# Altium schematic sheet WEATHER_PCB.SchDoc
size A3; SheetNumber: 1; SheetTotal: 1
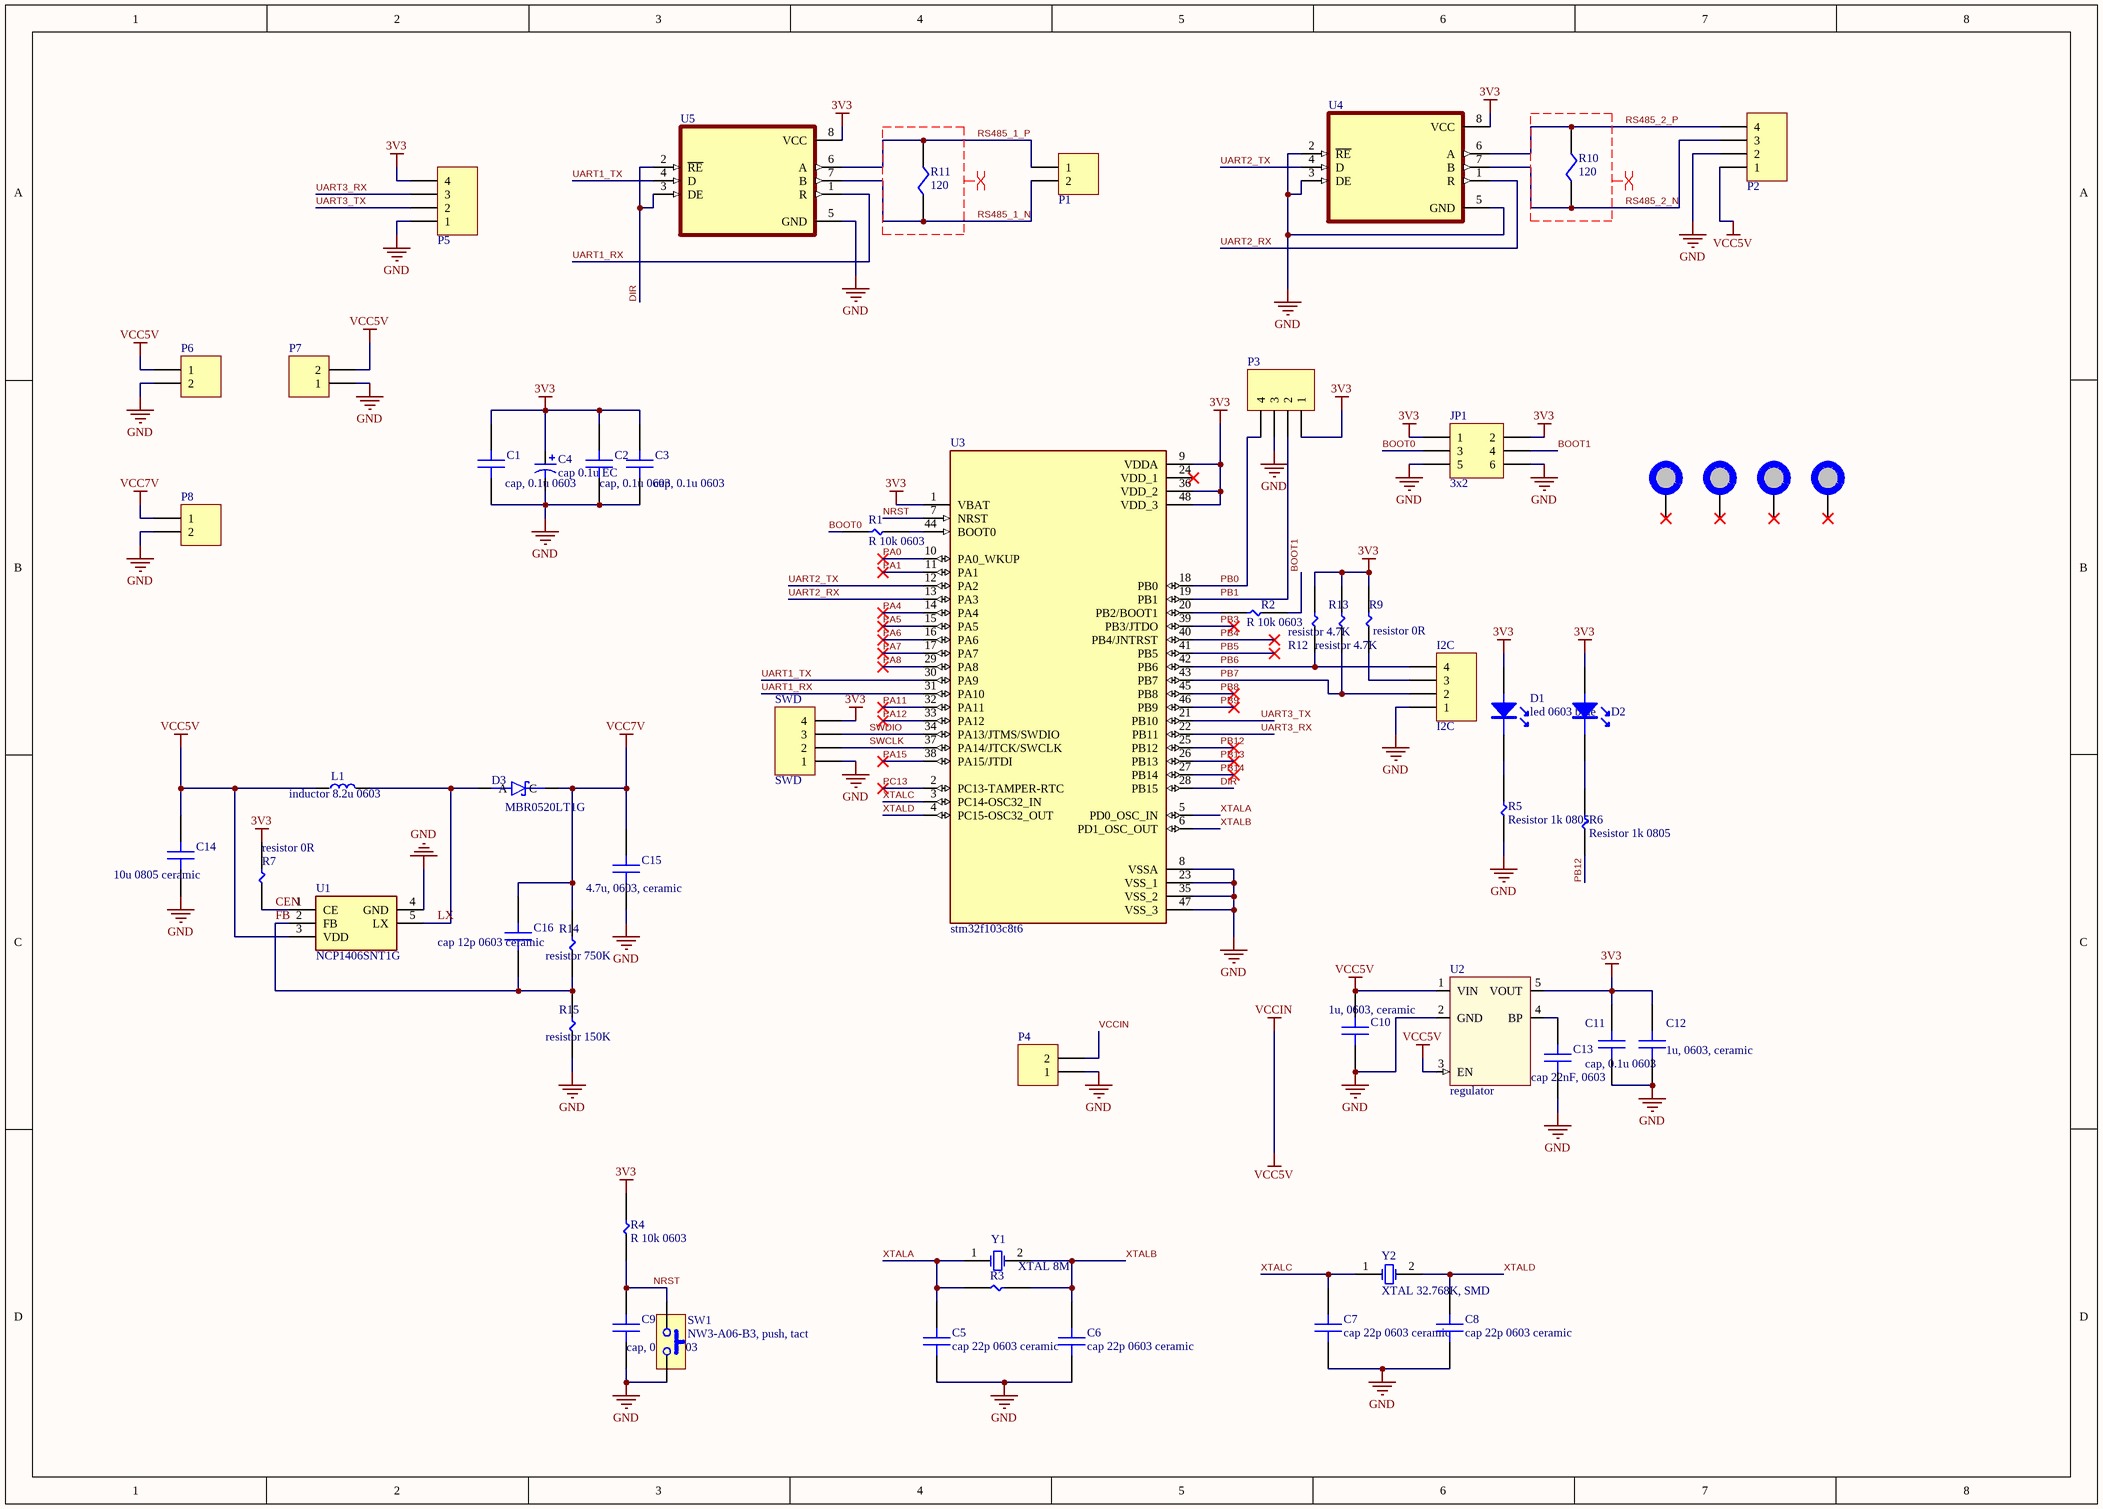
[diagram p0: WEATHER_PCB.SchDoc]

## Parts
C1  cap, 0.1u 0603  [CAP0.1u_0603_ceramic]
C2  cap, 0.1u 0603  [CAP0.1u_0603_ceramic]
C3  cap, 0.1u 0603  [CAP0.1u_0603_ceramic]
C4  cap 0.1u EC  [CAP0.1u_D55_EC]
C5  cap 22p 0603 ceramic  [CAP22p_0603_ceramic]
C6  cap 22p 0603 ceramic  [CAP22p_0603_ceramic]
C7  cap 22p 0603 ceramic  [CAP22p_0603_ceramic]
C8  cap 22p 0603 ceramic  [CAP22p_0603_ceramic]
C9  cap, 0.1u 0603  [CAP0.1u_0603_ceramic]
C10  1u, 0603, ceramic  [CAP1u_0603_ceramic]
C11  cap, 0.1u 0603  [CAP0.1u_0603_ceramic]
C12  1u, 0603, ceramic  [CAP1u_0603_ceramic]
C13  cap 22nF, 0603  [CAP22n_0603_ceramic]
C14  10u 0805 ceramic  [CAP10u_0805_ceramic]
C15  4.7u, 0603, ceramic  [CAP4.7u_0603_ceramic]
C16  cap 12p 0603 ceramic  [CAP12p_0603_ceramic]
D1  led 0603 blue  [LED0603_BLUE]
D2  LED  [LED0603_GREEN]  (value not drawn)
D3  MBR0520LT1G  [SOD3716X135N]
I2C  I2C  [HEADER4X1]
JP1  3x2  [HDR3X2]
L1  inductor 8.2u 0603  [IND8.2u_0603]
MH1  NC  [MH_2.2MMD_NC]  (value not drawn)
MH2  NC  [MH_2.2MMD_NC]  (value not drawn)
MH3  NC  [MH_2.2MMD_NC]  (value not drawn)
MH4  NC  [MH_2.2MMD_NC]  (value not drawn)
P1  2x1 2.54mm  [HEADER2X1]  (value not drawn)
P2  HEADER4X1  [HEADER4X1]  (value not drawn)
P3  HEADER4X1  [HEADER4X1]  (value not drawn)
P4  Header 2  [HDR1X2]  (value not drawn)
P5  HEADER4X1  [HEADER4X1]  (value not drawn)
P6  Header2x1_1.25  [Header2x1_1.25]  (value not drawn)
P7  Header 2  [HDR1X2]  (value not drawn)
P8  Header 2  [HDR1X2]  (value not drawn)
R1  R 10k 0603  [RES10K_0603]
R2  R 10k 0603  [RES10K_0603]
R3  resistor 10M 0603  [RES10M_0603]  (value not drawn)
R4  R 10k 0603  [RES10K_0603]
R5  Resistor 1k 0805  [RES1K_0805]
R6  Resistor 1k 0805  [RES1K_0805]
R7  resistor 0R  [RES_0R_0805]
R9  resistor 0R  [RES_0R_0805]
R10  120  [RES120_0805]
R11  120  [RES120_0805]
R12  resistor 4.7K  [RES_0R_0805]
R13  resistor 4.7K  [RES_0R_0805]
R14  resistor 750K  [RES750K_0603]
R15  resistor 150K  [RES150K_0603]
SW1  NW3-A06-B3, push, tact  [SW_TACT1]
SWD  SWD  [HEADER4X1]
U1  NCP1406SNT1G  [SOT95P275X110-5N]
U2  regulator  [RT9193-33]
U3  stm32f103c8t6  [QFP50P900X900X160-48N]
U4  rs485 transciver SN65HVD12DR  [RS485_Transciver_SN65HVD12DR]  (value not drawn)
U5  rs485 transciver SN65HVD12DR  [RS485_Transciver_SN65HVD12DR]  (value not drawn)
Y1  XTAL 8M  [XTAL_SMD_8M]
Y2  XTAL 32.768K, SMD  [XTAL32.768K]

## Nets
3V3: C1.2 C2.2 C3.2 C4.1 C11.2 C12.2 D1.A D2.A JP1.1 JP1.2 P3.1 P5.4 R4.2 R7.2 R9.2 R12.2 R13.2 SWD.4 U2.5(VOUT) U3.1(VBAT) U3.9(VDDA) U3.36(VDD_2) U3.48(VDD_3) U4.8(VCC) U5.8(VCC)
GND: C1.1 C2.1 C3.1 C4.2 C5.1 C6.1 C7.1 C8.1 C9.1 C10.1 C11.1 C12.1 C13.1 C14.1 C15.1 I2C.1 JP1.5 JP1.6 P2.2 P3.3 P4.1 P5.1 P6.2 P7.1 P8.2 R5.1 R15.1 SW1.2 SWD.1 U1.4(GND) U2.2(GND) U3.8(VSSA) U3.23(VSS_1) U3.35(VSS_2) U3.47(VSS_3) U4.2(~{RE}) U4.3(DE) U4.5(GND) U5.5(GND)
VCC7V: C15.2 C16.2 D3.C P8.1 R14.2
VCCIN: C10.2 C14.2 L1.1 P2.1 P4.2 P6.1 P7.2 U1.3(VDD) U2.1(VIN) U2.3(EN)  [also labelled VCC5V]
BOOT0: JP1.3 R1.2
BOOT1: JP1.4 R2.1
CEN: R7.1 U1.1(CE)
DIR: U3.28(PB15) U5.2(~{RE}) U5.3(DE)
FB: C16.1 R14.1 R15.2 U1.2(FB)
LX: D3.A L1.2 U1.5(LX)
NRST: C9.2 R4.1 SW1.1 U3.7(NRST)
PA0: U3.10(PA0_WKUP)
PA1: U3.11(PA1)
PA4: U3.14(PA4)
PA5: U3.15(PA5)
PA6: U3.16(PA6)
PA7: U3.17(PA7)
PA8: U3.29(PA8)
PA11: U3.32(PA11)
PA12: U3.33(PA12)
PA15: U3.38(PA15/JTDI)
PB0: P3.4 U3.18(PB0)
PB1: P3.2 U3.19(PB1)
PB3: U3.39(PB3/JTDO)
PB4: U3.40(PB4/JNTRST)
PB5: U3.41(PB5)
PB6: I2C.4 R12.1 U3.42(PB6)
PB7: I2C.2 R13.1 U3.43(PB7)
PB8: U3.45(PB8)
PB9: U3.46(PB9)
PB12: R6.1 U3.25(PB12)
PB13: U3.26(PB13)
PB14: U3.27(PB14)
PC13: U3.2(PC13-TAMPER-RTC)
RS485_1_N: P1.2 R11.1 U5.7(B)
RS485_1_P: P1.1 R11.2 U5.6(A)
RS485_2_N: P2.3 R10.1 U4.7(B)
RS485_2_P: P2.4 R10.2 U4.6(A)
SWCLK: SWD.2 U3.37(PA14/JTCK/SWCLK)
SWDIO: SWD.3 U3.34(PA13/JTMS/SWDIO)
UART1_RX: U3.31(PA10) U5.1(R)
UART1_TX: U3.30(PA9) U5.4(D)
UART2_RX: U3.13(PA3) U4.1(R)
UART2_TX: U3.12(PA2) U4.4(D)
UART3_RX: P5.3 U3.22(PB11)
UART3_TX: P5.2 U3.21(PB10)
XTALA: C5.2 R3.1 U3.5(PD0_OSC_IN) Y1.1(OSC1)
XTALB: C6.2 R3.2 U3.6(PD1_OSC_OUT) Y1.2(OSC2)
XTALC: C7.2 U3.3(PC14-OSC32_IN) Y2.1(OSC1)
XTALD: C8.2 U3.4(PC15-OSC32_OUT) Y2.2(OSC2)
NetC13_2: C13.2 U2.4(BP)
NetD1_K: D1.K R5.2
NetD2_K: D2.K R6.2
NetI2C_3: I2C.3 R9.1
NetR1_1: R1.1 U3.44(BOOT0)
NetR2_2: R2.2 U3.20(PB2/BOOT1)

Not connected (* = marked no-connect by the designer): MH1 1*; MH2 1*; MH3 1*; MH4 1*; U3 24(VDD_1)*

## Layout directives
differential pair: (no net found under the mark)

## Library data of the parts
C1-C3 C9 C11 = CAP0.1u_0603_ceramic
C4 = CAP0.1u_D55_EC
C5-C8 = CAP22p_0603_ceramic
C10 C12 = CAP1u_0603_ceramic
C13 = CAP22n_0603_ceramic
C14 = CAP10u_0805_ceramic
C15 = CAP4.7u_0603_ceramic
C16 = CAP12p_0603_ceramic
D1 = LED0603_BLUE
D2 = LED0603_GREEN
D3 = MBR0520LT1G: Diode Schottky 20V 0.5A Automotive 2-Pin SOD-123 T/R; MF: ON Semiconductor; MP: MBR 0520LT1G; Value: *; Availability: Unavailable; Package: None; SnapEDA_Link: https://www.snapeda.com/parts/MBR%200520LT1G/ON%20Semiconductor/view-part/4423193/?ref=snap; Price: None
I2C SWD = HEADER4X1
JP1 = HEADER3X2: header 3x2
L1 = IND8.2u_0603: 10%  [Abracon LLC] AIML-0603-8R2K-T  FIXED IND 8.2UH 4MA 2.1 OHM SMD
MH1-MH4 = MH_2.2MMD_NC: not copper, drill, 2.2mm
P1 = HEADER2X1
P4 P7 P8 = Header 2: Header, 2-Pin; LatestRevisionDate: 17-Jul-2002; LatestRevisionNote: Re-released for DXP Platform.; Publisher: Altium Limited
R1 R2 R4 = RES10K_0603
R3 = RES10M_0603
R5 R6 = RES1K_0805
R7 R9 R12-R15 = RES_0R_0805
R10 R11 = RES120_0805
SW1 = SW_TACT1: NW3-A06-B3
U1 = NCP1406SNT1G: Integrated Circuit; Manufacturer_Name: ON Semiconductor; Datasheet Link: http://www.onsemi.com/pub/Collateral/NCP1406-D.PDF; Height: 1.1mm; Manufacturer_Part_Number: NCP1406SNT1G; Mouser Part Number: 863-NCP1406SNT1G; Mouser Price/Stock: https://www.mouser.co.uk/ProductDetail/ON-Semiconductor/NCP1406SNT1G?qs=%2FugrpAKHX8o%2F0x49StmZ3A%3D%3D; Arrow Part Number: NCP1406SNT1G; Arrow Price/Stock: https://www.arrow.com/en/products/ncp1406snt1g/on-semiconductor
U2 = RT9193-33: RT9193-33, Regulator
U3 = stm32f103c8t6: Integrated Circuit; Manufacturer_Name: STMicroelectronics; Datasheet Link: https://www.st.com/resource/en/datasheet/stm32f103c8.pdf; Height: 1.6mm; Manufacturer_Part_Number: stm32f103c8t6; Mouser Part Number: 511-STM32F103C8T6; Mouser Price/Stock: https://www.mouser.co.uk/ProductDetail/STMicroelectronics/STM32F103C8T6/?qs=bhCVus9SdFtq6kqxsU5%2FDA%3D%3D; Arrow Part Number: STM32F103C8T6; Arrow Price/Stock: https://www.arrow.com/en/products/stm32f103c8t6/stmicroelectronics
U4 U5 = RS485_Transciver_SN65HVD12DR
Y1 = XTAL8M
Y2 = XTAL32.768K